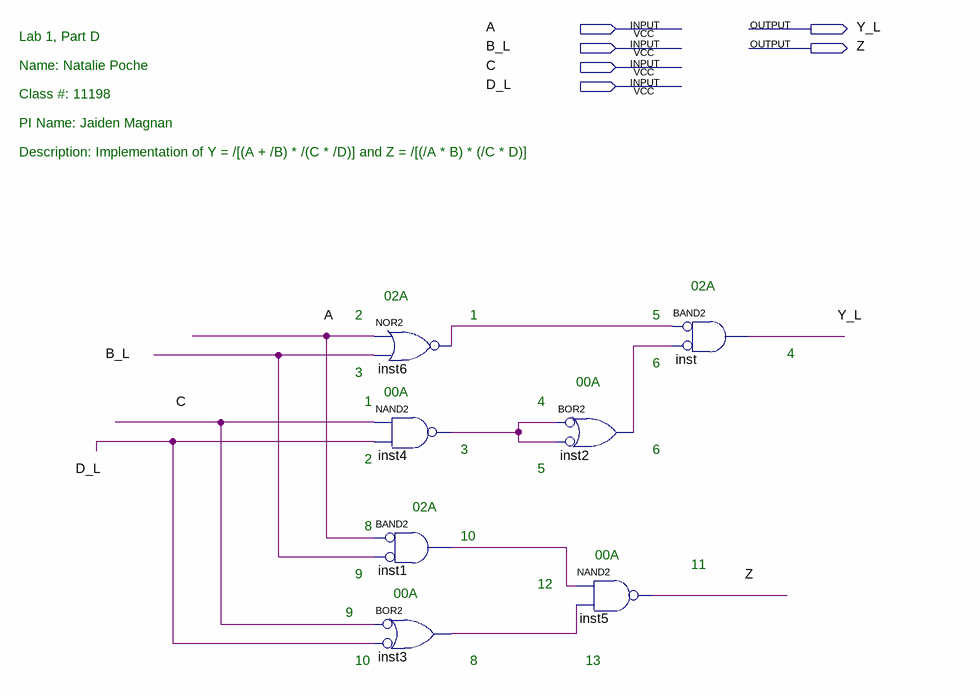
[diagram p0: schematic sheet]
// Quartus schematic Lab1d.bdf as structural Verilog: 7 symbols, 6 pins
module Lab1d (
  input  A,
  input  B_L,
  input  C,
  input  D_L,
  output Y_L,
  output Z
);

  wire inst1_out, inst2_out, inst3_out, inst4_out, inst6_out;

  nor inst6 (inst6_out, A, B_L);
  nand inst4 (inst4_out, C, D_L);
  and inst1 (inst1_out, ~A, ~B_L);  // BAND2
  or inst3 (inst3_out, ~C, ~D_L);  // BOR2
  or inst2 (inst2_out, ~inst4_out, ~inst4_out);  // BOR2
  nand inst5 (Z, inst1_out, inst3_out);
  and inst (Y_L, ~inst6_out, ~inst2_out);  // BAND2

  // Notes on the sheet:
  //   Lab 1, Part D
  //   Name: Natalie Poche
  //   Class #: 11198
  //   PI Name: Jaiden Magnan
  //   Description: Implementation of Y = /[(A + /B) * /(C * /D)] and Z = /[(/A * B) * (/C * D)]
  //   02A
  //   02A
  //   2
  //   1
  //   5
  //   4
  //   6
  //   3
  //   00A
  //   00A
  //   1
  //   4
  //   3
  //   6
  //   2
  //   5
  //   02A
  //   8
  //   10
  //   00A
  //   11
  //   9
  //   12
  //   00A
  //   9
  //   10
  //   8
  //   13
endmodule
